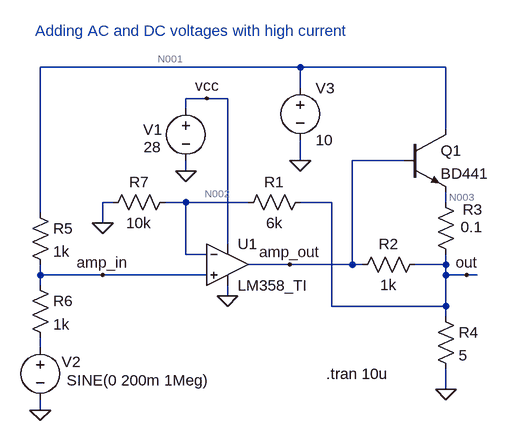
[diagram p0: schematic 05-lm358_high_current_output.asc]
* 05-lm358_high_current_output.asc
V1 vcc 0 28
* U1: LM358_TI (symbol ZZZ\OpAmp\LM358_TI not available, pins judged from their places): In+=amp_in In-=N002 V+=vcc V-=0 OUT=amp_out
V2 N004 0 SINE(0 200m 1Meg)
R2 out amp_out 1k
Q1 N001 amp_out N003 0 BD441
R3 N003 out 0.1
V3 N001 0 10
R4 out 0 5
R5 N001 amp_in 1k
R6 amp_in N004 1k
R1 out N002 6k
R7 N002 0 10k
.model NPN NPN
.model PNP PNP
.lib standard.bjt
.tran 10u
* Adding AC and DC voltages with high current
.backanno
.end

* Results of the author's LTspice run, read from the files saved beside the schematic
* Operating Point, zero values left out:
*   V(vcc) = 28 V
*   V(amp_out) = 8.912 V
*   V(n002) = 5 V
*   V(amp_in) = 5 V
*   V(out) = 8.001 V
*   V(n001) = 10 V
*   V(n003) = 8.161 V
*   Ic(Q1) = 1.57 A
*   Ib(Q1) = 29.23 mA
*   Ie(Q1) = -1.6 A
*   I(R2) = -911 µA
*   I(R3) = 1.6 A
*   I(R4) = 1.6 A
*   I(R5) = 5 mA
*   I(R6) = 5 mA
*   I(R1) = 500 µA
*   I(R7) = 500 µA
*   I(V1) = -933.8 µA
*   I(V2) = 5 mA
*   I(V3) = -1.575 A
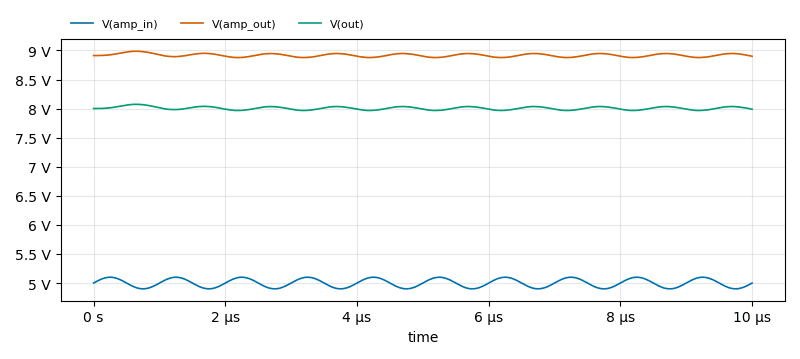
[diagram p1: Transient Analysis of 05-lm358_high_current_output.asc, plotted from the saved traces]
* Transient Analysis, 1 run:
*   V(amp_in): min 4.9 V, max 5.1 V, average 5 V, rms 5.001 V, last 5 V
*   V(amp_out): min 8.877 V, max 8.986 V, average 8.917 V, rms 8.917 V, last 8.9 V
*   V(out): min 7.967 V, max 8.073 V, average 8.006 V, rms 8.006 V, last 7.99 V